# Altium schematic sheet Hall_sensor.SchDoc
size A
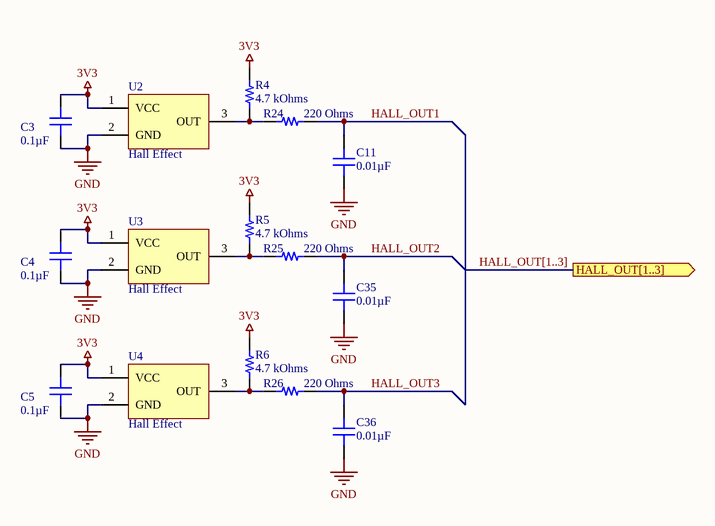
[diagram p0: Hall_sensor.SchDoc]

## Parts
C3  0.1µF  [CAP 0603_1608]
C4  0.1µF  [CAP 0603_1608]
C5  0.1µF  [CAP 0603_1608]
C11  0.01µF  [CAP 0603_1608]
C35  0.01µF  [CAP 0603_1608]
C36  0.01µF  [CAP 0603_1608]
R4  4.7 kOhms  [RES 0603_1608]
R5  4.7 kOhms  [RES 0603_1608]
R6  4.7 kOhms  [RES 0603_1608]
R24  220 Ohms  [RES 0603_1608]
R25  220 Ohms  [RES 0603_1608]
R26  220 Ohms  [RES 0603_1608]
U2  Hall Effect  [DRV5011ADLPG]
U3  Hall Effect  [DRV5011ADLPG]
U4  Hall Effect  [DRV5011ADLPG]

## Ports
HALL_OUT[1..3] (out)

## Nets
3V3: C3.1 C4.1 C5.1 R4.2 R5.1 R6.1 U2.1(VCC) U3.1(VCC) U4.1(VCC)
GND: C3.2 C4.2 C5.2 C11.1 C35.1 C36.1 U2.2(GND) U3.2(GND) U4.2(GND)
HALL_OUT1: C11.2 R24.2
HALL_OUT2: C35.2 R25.2
HALL_OUT3: C36.2 R26.2
NetR4_1: R4.1 R24.1 U2.3(OUT)
NetR5_2: R5.2 R25.1 U3.3(OUT)
NetR6_2: R6.2 R26.1 U4.3(OUT)

## Buses and harness runs
bus HALL_OUT[1..3] = port HALL_OUT[1..3]

## Library data of the parts
C3-C5 = GCG188R92A104KA03D: CAP CER 0.1UF 100V 0603 EPOXY; Manufacturer: Murata Electronics; Temperature Coefficient: X8R; Tolerance: ±10%; Part Number: GCG188R92A104KA03D; Value: 0.1µF; Applications: Automotive; Capacitance: 0.1µF; ComponentLink1Description: Datasheet; ComponentLink1URL: https://search.murata.co.jp/Ceramy/image/img/A01X/G101/ENG/GCG188R92A104KA03-01.pdf; ComponentLink2Description: DigiKey Link; ComponentLink2URL: http://digikey.com/product-detail/en/murata-electronics/GCG188R92A104KA03D/490-18197-1-ND/9867926; Device Package: 0603 (1608 Metric); Features: Epoxy Mountable; LastUpdated: 21-Jan-20 12:01:59 AM; Lifecycle Status: Active; Minimum Order: 1; Mounting Type: Surface Mount, MLCC, Epoxy; Operating Temperature: -55°C ~ 150°C; Package / Case: 0603 (1608 Metric); Packaging: TapeAndReel; PartId: 9025; Part Status: Active; Price: 0.07; Ratings: AEC-Q200; Series: GCG; Size / Dimension: 0.063" L x 0.031" W (1.60mm x 0.80mm); Supplier 1: DigiKey; Supplier Part Number 1: 490-18197-1-ND; Thickness (Max): 0.035" (0.90mm); Voltage - Rated: 100V
C11 C35 C36 = C0603C103KARACAUTO: CAP CER 0.01UF 250V X7R 0603; Manufacturer: KEMET; Tolerance: ±10%; Part Number: C0603C103KARACAUTO; Value: 0.01µF; Applications: Automotive, Bypass, Decoupling; Capacitance: 0.01µF; ComponentLink1Description: Datasheet; ComponentLink1URL: https://api.kemet.com/component-edge/download/datasheet/C0603C103KARACAUTO.pdf; ComponentLink2Description: DigiKey Link; ComponentLink2URL: http://digikey.com/product-detail/en/kemet/C0603C103KARACAUTO/399-17960-1-ND/9084030; Device Package: 0603 (1608 Metric); LastUpdated: 13-Aug-20 10:21:06 AM; Lifecycle Status: Active; Minimum Order: 1; Mounting Type: Surface Mount, MLCC; Operating Temperature: -55°C ~ 125°C; Package / Case: 0603 (1608 Metric); Packaging: TapeAndReel; PartId: 15195; Part Status: Active; Price: 0.25; Ratings: AEC-Q200; Series: SMD Auto X7R; Size / Dimension: 0.063" L x 0.031" W (1.60mm x 0.80mm); Supplier 1: DigiKey; Supplier Part Number 1: 399-17960-1-ND; Temperature Coefficient: X7R; Thickness (Max): 0.034" (0.87mm)
R4-R6 = CRCW06034K70FKTA: RES SMD 4.7K OHM 1% 1/10W 0603; Manufacturer: Vishay Dale; Power (Watts): 0.1W, 1/10W; Temperature Coefficient: ±100ppm/°C; Part Number: CRCW06034K70FKTA; Value: 4.7 kOhms; ComponentLink1Description: Datasheet; ComponentLink1URL: http://www.vishay.com/docs/20008/dcrcw.pdf; ComponentLink2Description: DigiKey Link; ComponentLink2URL: http://digikey.com/product-detail/en/vishay-dale/CRCW06034K70FKTA/541-3004-1-ND/6073647; Composition: Thick Film; Device Package: 0603 (1608 Metric); Features: Automotive AEC-Q200; Height - Seated (Max): 0.020" (0.50mm); LastUpdated: 21-Jan-20 12:16:37 AM; Lifecycle Status: Active; Minimum Order: 1; Number of Terminations: 2; Operating Temperature: -55°C ~ 155°C; Package / Case: 0603 (1608 Metric); Packaging: TapeAndReel; PartId: 23863; Part Status: Active; Price: 0.01; Ratings: AEC-Q200; Resistance: 4.7 kOhms; Series: CRCW; Size / Dimension: 0.063" L x 0.033" W (1.60mm x 0.85mm); Supplier 1: DigiKey; Supplier Part Number 1: 541-3004-1-ND; Supplier Device Package: 0603; Tolerance: ±1%
R24-R26 = SDR03EZPJ221: RES SMD 220 OHM 5% 0.3W 0603; Manufacturer: Rohm Semiconductor; Temperature Coefficient: ±200ppm/°C; Part Number: SDR03EZPJ221; Value: 220 Ohms; ComponentLink1Description: Datasheet; ComponentLink1URL: https://www.rohm.com/datasheet/SDR03EZPJ/sdr-e; ComponentLink2Description: DigiKey Link; ComponentLink2URL: http://digikey.com/product-detail/en/rohm-semiconductor/SDR03EZPJ221/511-1752-1-ND/9675103; Composition: Thick Film; Device Package: 0603 (1608 Metric); Features: Pulse Withstanding; Height - Seated (Max): 0.022" (0.55mm); LastUpdated: 13-Aug-20 10:37:09 AM; Lifecycle Status: Active; Minimum Order: 1; Number of Terminations: 2; Operating Temperature: -55°C ~ 155°C; Package / Case: 0603 (1608 Metric); Packaging: TapeAndReel; PartId: 6903; Part Status: Active; Power (Watts): 0.3W; Price: 0.01; Resistance: 220 Ohms; Series: SDR03; Size / Dimension: 0.063" L x 0.031" W (1.60mm x 0.80mm); Supplier 1: DigiKey; Supplier Part Number 1: 511-1752-1-ND; Supplier Device Package: 0603; Tolerance: ±5%
U2-U4 = DRV5011